# EAGLE schematic BPSKModulator (EAGLE 6.5.0)
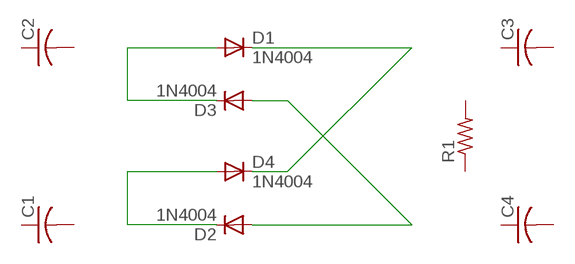
[diagram p0: schematic, sheet 1]

## Parts
C1  C-USC0603  [C0603]
C2  C-USC0603  [C0603]
C3  C-USC0603  [C0603]
C4  C-USC0603  [C0603]
D1  1N4004  [DO41-10]
D2  1N4004  [DO41-10]
D3  1N4004  [DO41-10]
D4  1N4004  [DO41-10]
R1  R-US_R0603  [R0603]

## Nets
N$1: D2.C D4.A
N$2: D1.A D3.C
N$3: D1.C D4.C
N$4: D2.A D3.A
Unconnected: C1.1 C1.2 C2.1 C2.2 C3.1 C3.2 C4.1 C4.2 R1.1 R1.2

## Library data of the parts
C1-C4 = rcl:C-US: CAPACITOR, American symbol
D1-D4 = adafruit:1N4004: DIODE General purpose 1N400x type rectifier (With bigger pads) http://www.ladyada.net/library/pcb/eaglelibrary.html
R1 = resistor:R-US_: RESISTOR, American symbol